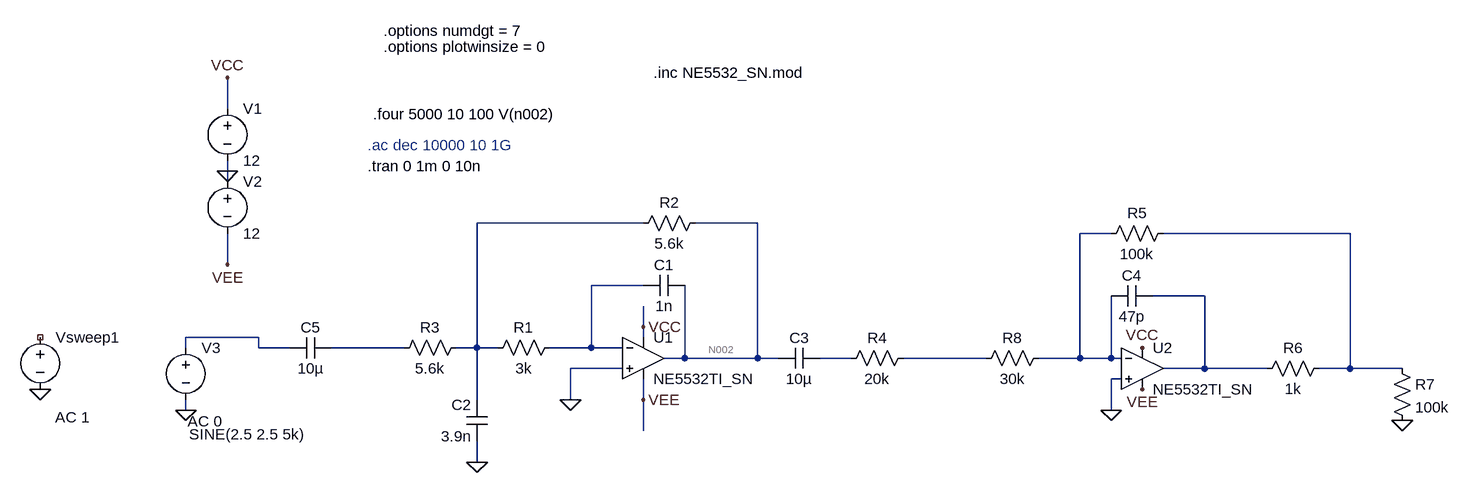
[diagram p0: schematic DAC_output.asc]
DAC_output.asc, the LTspice schematic file:
Version 4
SHEET 1 1564 836
WIRE -320 192 -320 144
WIRE -320 288 -320 272
WIRE -320 304 -320 288
WIRE 320 368 64 368
WIRE 496 368 400 368
WIRE 1040 384 992 384
WIRE 1408 384 1120 384
WIRE -320 432 -320 384
WIRE 320 464 240 464
WIRE 1184 480 1104 480
WIRE 320 528 320 496
WIRE -272 544 -384 544
WIRE 320 544 320 528
WIRE -384 560 -384 544
WIRE -272 560 -272 544
WIRE -224 560 -272 560
WIRE -48 560 -160 560
WIRE 64 560 64 368
WIRE 64 560 32 560
WIRE 96 560 64 560
WIRE 240 560 240 464
WIRE 240 560 176 560
WIRE 288 560 240 560
WIRE 384 576 384 464
WIRE 384 576 352 576
WIRE 496 576 496 368
WIRE 496 576 384 576
WIRE 528 576 496 576
WIRE 640 576 592 576
WIRE 848 576 720 576
WIRE 992 576 992 384
WIRE 992 576 928 576
WIRE 1040 576 1040 480
WIRE 1040 576 992 576
WIRE 1056 576 1040 576
WIRE 288 592 208 592
WIRE 1184 592 1184 480
WIRE 1184 592 1120 592
WIRE 1280 592 1184 592
WIRE 1408 592 1408 384
WIRE 1408 592 1360 592
WIRE 1488 592 1408 592
WIRE 1056 608 1040 608
WIRE 64 640 64 560
WIRE 208 640 208 592
WIRE 320 640 320 608
WIRE -384 656 -384 640
WIRE 1040 656 1040 608
WIRE 320 688 320 640
WIRE 64 736 64 704
FLAG -320 288 0
FLAG -320 144 VCC
FLAG -320 432 VEE
FLAG 320 528 VCC
FLAG 320 640 VEE
FLAG -608 624 0
FLAG -384 656 0
FLAG 64 736 0
FLAG 1488 672 0
FLAG 1040 656 0
FLAG 1088 560 VCC
FLAG 1088 624 VEE
FLAG 208 640 0
DATAFLAG -320 544 ""
SYMBOL Opamps\\opamp2 320 512 R0
SYMATTR InstName U1
SYMATTR Value NE5532TI_SN
SYMBOL voltage -320 176 R0
WINDOW 123 0 0 Left 0
WINDOW 39 0 0 Left 0
SYMATTR InstName V1
SYMATTR Value 12
SYMBOL voltage -320 288 R0
WINDOW 123 0 0 Left 0
WINDOW 39 0 0 Left 0
SYMATTR InstName V2
SYMATTR Value 12
SYMBOL res 192 544 R90
WINDOW 0 0 56 VBottom 2
WINDOW 3 32 56 VTop 2
SYMATTR InstName R1
SYMATTR Value 3k
SYMBOL res 416 352 R90
WINDOW 0 0 56 VBottom 2
WINDOW 3 32 56 VTop 2
SYMATTR InstName R2
SYMATTR Value 5.6k
SYMBOL voltage -608 528 R0
WINDOW 3 24 152 Left 2
WINDOW 123 23 139 Left 2
WINDOW 39 0 0 Left 0
SYMATTR Value ""
SYMATTR Value2 AC 1
SYMATTR InstName Vsweep1
SYMBOL cap 384 448 R90
WINDOW 0 0 32 VBottom 2
WINDOW 3 32 32 VTop 2
SYMATTR InstName C1
SYMATTR Value 1n
SYMBOL voltage -384 544 R0
WINDOW 3 5 149 Left 2
WINDOW 123 3 129 Left 2
WINDOW 39 0 0 Left 0
SYMATTR Value SINE(2.5 2.5 5k)
SYMATTR Value2 AC 0
SYMATTR InstName V3
SYMBOL res 48 544 R90
WINDOW 0 0 56 VBottom 2
WINDOW 3 32 56 VTop 2
SYMATTR InstName R3
SYMATTR Value 5.6k
SYMBOL cap 80 704 R180
WINDOW 0 24 56 Left 2
WINDOW 3 24 8 Left 2
SYMATTR InstName C2
SYMATTR Value 3.9n
SYMBOL cap 592 560 R90
WINDOW 0 0 32 VBottom 2
WINDOW 3 32 32 VTop 2
SYMATTR InstName C3
SYMATTR Value 10µ
SYMBOL Opamps\\opamp2 1088 528 R0
SYMATTR InstName U2
SYMATTR Value NE5532TI_SN
SYMBOL res 736 560 R90
WINDOW 0 0 56 VBottom 2
WINDOW 3 32 56 VTop 2
SYMATTR InstName R4
SYMATTR Value 20k
SYMBOL cap 1104 464 R90
WINDOW 0 0 32 VBottom 2
WINDOW 3 32 32 VTop 2
SYMATTR InstName C4
SYMATTR Value 47p
SYMBOL res 1136 368 R90
WINDOW 0 0 56 VBottom 2
WINDOW 3 32 56 VTop 2
SYMATTR InstName R5
SYMATTR Value 100k
SYMBOL res 1376 576 R90
WINDOW 0 0 56 VBottom 2
WINDOW 3 32 56 VTop 2
SYMATTR InstName R6
SYMATTR Value 1k
SYMBOL res 1472 576 R0
SYMATTR InstName R7
SYMATTR Value 100k
SYMBOL res 944 560 R90
WINDOW 0 0 56 VBottom 2
WINDOW 3 32 56 VTop 2
SYMATTR InstName R8
SYMATTR Value 30k
SYMBOL cap -160 544 R90
WINDOW 0 0 32 VBottom 2
WINDOW 3 32 32 VTop 2
SYMATTR InstName C5
SYMATTR Value 10µ
TEXT 336 136 Left 2 !.inc NE5532_SN.mod
TEXT -104 280 Left 2 !.tran 0 1m 0 10n
TEXT -104 248 Left 2 ;.ac dec 10000 10 1G
TEXT -96 200 Left 2 !.four 5000 10 100 V(n002)
TEXT -80 72 Left 2 !.options numdgt = 7
TEXT -80 96 Left 2 !.options plotwinsize = 0

The netlist it stands for:
* DAC_output.asc
XU1 0 N005 VCC VEE N002 NE5532TI_SN  ; pins In+ In- V+ V- OUT
V1 VCC 0 12
V2 0 VEE 12
R1 N005 N001 3k
R2 N002 N001 5.6k
Vsweep1 NC_01 0 AC 1
C1 N002 N005 1n
V3 N007 0 SINE(2.5 2.5 5k) AC 0
R3 N001 N008 5.6k
C2 0 N001 3.9n
C3 N009 N002 10µ
XU2 0 N003 VCC VEE N006 NE5532TI_SN  ; pins In+ In- V+ V- OUT
R4 N010 N009 20k
C4 N006 N003 47p
R5 N004 N003 100k
R6 N004 N006 1k
R7 N004 0 100k
R8 N003 N010 30k
C5 N008 N007 10µ
.inc NE5532_SN.mod
.tran 0 1m 0 10n
* .ac dec 10000 10 1G
.four 5000 10 100 V(n002)
.options numdgt = 7
.options plotwinsize = 0
.backanno
.end